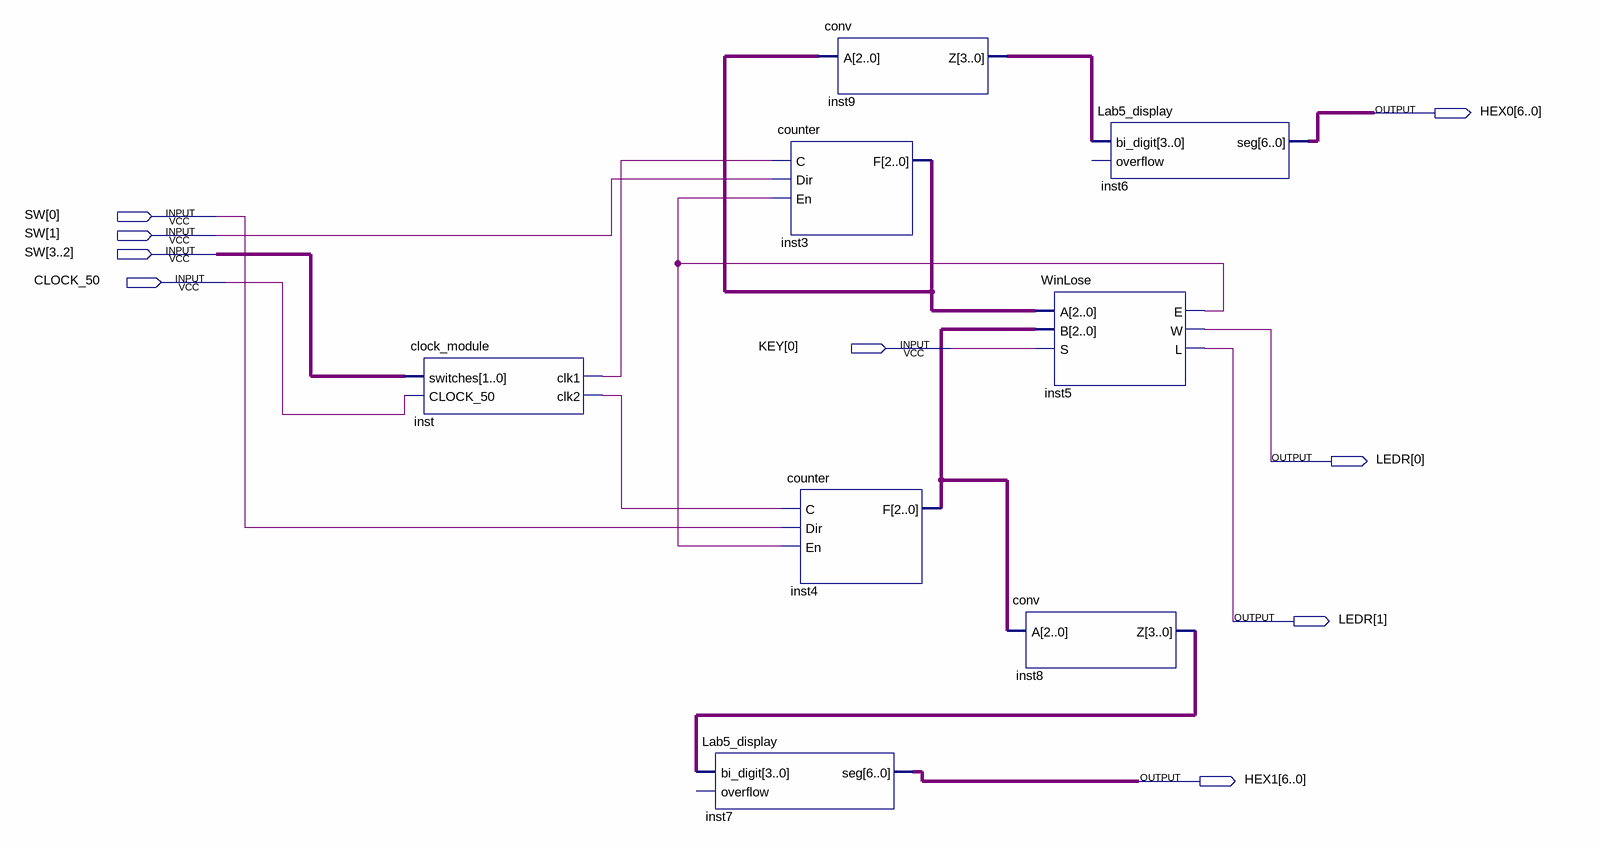
[diagram p0: schematic sheet]
// Quartus schematic lab7.bdf as structural Verilog: 8 symbols, 9 pins
module lab7 (
  input  [3:0] SW,
  input  CLOCK_50,
  input  [0:0] KEY,
  output [6:0] HEX0,
  output [1:0] LEDR,
  output [6:0] HEX1
);

  wire inst5_e, inst_clk1, inst_clk2;
  wire [2:0] inst3_f, inst4_f;
  wire [3:0] inst8_z, inst9_z;

  clock_module inst (.switches(SW[3:2]), .CLOCK_50(CLOCK_50), .clk1(inst_clk1), .clk2(inst_clk2));
  Lab5_display inst7 (.bi_digit(inst8_z), .seg(HEX1));  // open: overflow
  conv inst9 (.A(inst3_f), .Z(inst9_z));
  counter inst3 (.C(inst_clk1), .Dir(SW[1]), .En(inst5_e), .F(inst3_f));
  counter inst4 (.C(inst_clk2), .Dir(SW[0]), .En(inst5_e), .F(inst4_f));
  WinLose inst5 (.A(inst3_f), .B(inst4_f), .S(KEY[0]), .E(inst5_e), .W(LEDR[0]), .L(LEDR[1]));
  conv inst8 (.A(inst4_f), .Z(inst8_z));
  Lab5_display inst6 (.bi_digit(inst9_z), .seg(HEX0));  // open: overflow
endmodule
